# Altium schematic sheet ZHZ_Balance.SchDoc
size A3
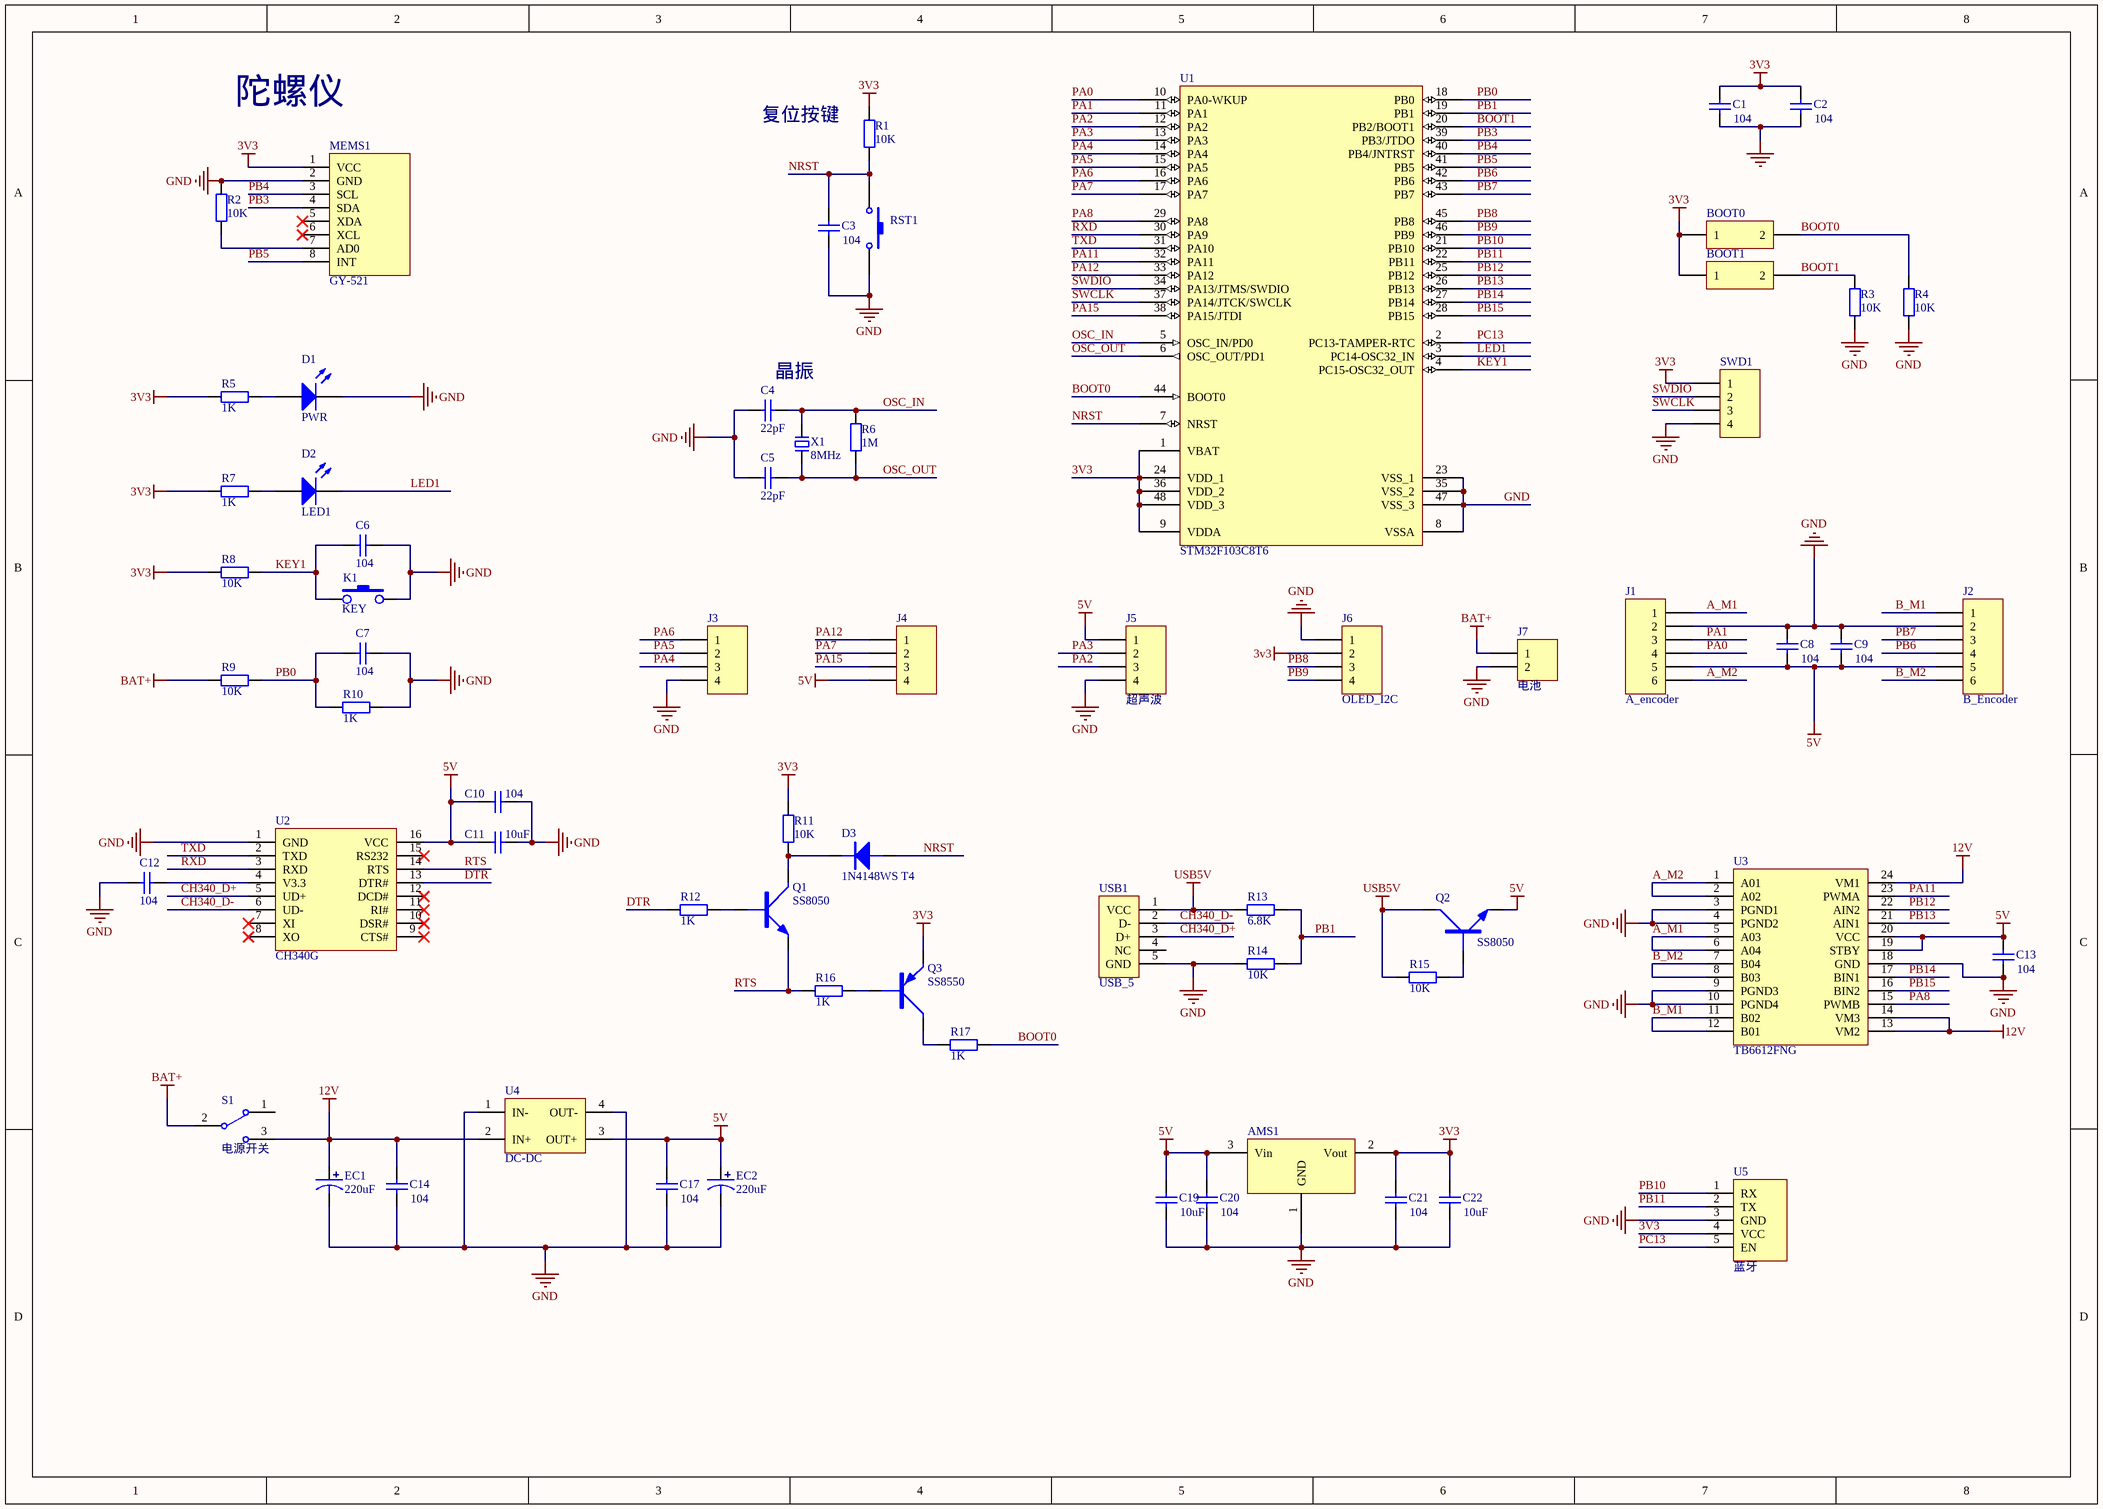
[diagram p0: ZHZ_Balance.SchDoc]

## Parts
AMS1  AMS1117  [SOT223]  (value not drawn)
BOOT0  拨码开关  [二脚排针]  (value not drawn)
BOOT1  拨码开关  [二脚排针]  (value not drawn)
C1  value 104  [0603C]  (hidden comment: Cap)
C2  value 104  [0603C]  (hidden comment: Cap)
C3  value 104  [0805C]  (hidden comment: Cap)
C4  value 22pF  [0805C]  (hidden comment: Cap)
C5  value 22pF  [0805C]  (hidden comment: Cap)
C6  value 104  [0805C]  (hidden comment: Cap)
C7  value 104  [0805C]  (hidden comment: Cap)
C8  value 104  [0805C]  (hidden comment: Cap)
C9  value 104  [0805C]  (hidden comment: Cap)
C10  value 104  [0805C]  (hidden comment: Cap)
C11  value 10uF  [0805C]  (hidden comment: Cap)
C12  value 104  [0805C]  (hidden comment: Cap)
C13  value 104  [0805C]  (hidden comment: Cap)
C14  value 104  [0805C]  (hidden comment: Cap)
C17  value 104  [0805C]  (hidden comment: Cap)
C19  value 10uF  [0805C]  (hidden comment: Cap)
C20  value 104  [0805C]  (hidden comment: Cap)
C21  value 104  [0805C]  (hidden comment: Cap)
C22  value 10uF  [0805C]  (hidden comment: Cap)
D1  PWR  [LED-0805Y]
D2  LED1  [LED-0805Y]
D3  1N4148WS T4  [SOD-123]
EC1  220uF  [SMD-EC8X8X10]
EC2  220uF  [SMD-EC8X8X10]
J1  A_encoder  [XH2.54-WS-6P]
J2  B_Encoder  [XH2.54-WS-6P]
J3  J?  [4脚排针]  (value not drawn)
J4  J?  [4脚排针]  (value not drawn)
J5  超声波  [四脚排母]
J6  OLED_I2C  [四脚排母]
J7  电池  [18650]
K1  KEY  [SMD-3X6X5]
MEMS1  GY-521  [陀螺仪]
Q1  SS8050  [SOT-23]
Q2  SS8050  [SOT-23]
Q3  SS8550  [SOT-23]
R1  value 10K  [0805R]  (hidden comment: Res2)
R2  value 10K  [0805R]  (hidden comment: Res2)
R3  value 10K  [0805R]  (hidden comment: Res2)
R4  value 10K  [0805R]  (hidden comment: Res2)
R5  value 1K  [0805R]  (hidden comment: Res2)
R6  value 1M  [0805R]  (hidden comment: Res2)
R7  value 1K  [0805R]  (hidden comment: Res2)
R8  value 10K  [0805R]  (hidden comment: Res2)
R9  value 10K  [0805R]  (hidden comment: Res2)
R10  value 1K  [0805R]  (hidden comment: Res2)
R11  value 10K  [0805R]  (hidden comment: Res2)
R12  value 1K  [0805R]  (hidden comment: Res2)
R13  value 6.8K  [0805R]  (hidden comment: Res2)
R14  value 10K  [0805R]  (hidden comment: Res2)
R15  value 10K  [0805R]  (hidden comment: Res2)
R16  value 1K  [0805R]  (hidden comment: Res2)
R17  value 1K  [0805R]  (hidden comment: Res2)
RST1  SW-PB  [SMD-3X6X5]  (value not drawn)
S1  电源开关  [SS-12D10]
SWD1  XH-4A  [XH2.54-LI-4P]  (value not drawn)
U1  STM32F103C8T6  [STM32F103C8T6]
U2  CH340G  [SOP16]
U3  TB6612FNG  [SSOP24]
U4  DC-DC  [DC_DC DOWN]
U5  蓝牙  [Fe-HDR1X5/2.54-S]
USB1  USB_5  [USB-MINI-A]
X1  8MHz  [OSC HC-49S]

## Nets
3V3: AMS1.2(Vout) BOOT0.1 BOOT1.1 C1.2 C2.2 C21.2 C22.2 J6.2 MEMS1.1(VCC) Q3.E R1.2 R5.2 R7.2 R8.2 R11.2 SWD1.1 U1.1(VBAT) U1.9(VDDA) U1.24(VDD_1) U1.36(VDD_2) U1.48(VDD_3) U5.4(VCC)
5V: AMS1.3(Vin) C8.1 C9.1 C10.2 C11.2 C13.2 C17.2 C19.2 C20.2 EC2.1 J1.5 J2.5 J4.4 J5.1 Q2.E U2.16(VCC) U3.19(STBY) U3.20(VCC) U4.3(OUT+)
12V: C14.2 EC1.1 S1.3 U3.13(VM2) U3.14(VM3) U3.24(VM1) U4.2(IN+)
BAT+: J7.1 R9.2 S1.2
GND: AMS1.1(GND) C1.1 C2.1 C3.1 C4.2 C5.2 C6.1 C7.1 C8.2 C9.2 C10.1 C11.1 C12.2 C13.1 C14.1 C17.1 C19.1 C20.1 C21.1 C22.1 D1.2(K) EC1.2 EC2.2 J1.2 J2.2 J3.4 J5.4 J6.1 J7.2 K1.2 MEMS1.2(GND) R2.2 R3.1 R4.1 R10.1 R14.2 RST1.2 SWD1.4 U1.8(VSSA) U1.23(VSS_1) U1.35(VSS_2) U1.47(VSS_3) U2.1(GND) U3.3(PGND1) U3.4(PGND2) U3.9(PGND3) U3.10(PGND4) U3.18(GND) U4.1(IN-) U4.4(OUT-) U5.3(GND) USB1.5(GND)
USB5V: Q2.C R13.2 R15.2 USB1.1(VCC)
A_M1: J1.1 U3.5(A03) U3.6(A04)
A_M2: J1.6 U3.1(A01) U3.2(A02)
B_M1: J2.1 U3.11(B02) U3.12(B01)
B_M2: J2.6 U3.7(B04) U3.8(B03)
BOOT0: BOOT0.2 R4.2 R17.1 U1.44(BOOT0)
BOOT1: BOOT1.2 R3.2 U1.20(PB2/BOOT1)
CH340_D+: U2.5(UD+) USB1.3(D+)
CH340_D-: U2.6(UD-) USB1.2(D-)
DTR: R12.2 U2.13(DTR#)
KEY1: C6.2 K1.1 R8.1 U1.4(PC15-OSC32_OUT)
LED1: D2.2(K) U1.3(PC14-OSC32_IN)
NRST: C3.2 D3.A R1.1 RST1.1 U1.7(NRST)
OSC_IN: C4.1 R6.2 U1.5(OSC_IN/PD0) X1.2
OSC_OUT: C5.1 R6.1 U1.6(OSC_OUT/PD1) X1.1
PA0: J1.4 U1.10(PA0-WKUP)
PA1: J1.3 U1.11(PA1)
PA2: J5.3 U1.12(PA2)
PA3: J5.2 U1.13(PA3)
PA4: J3.3 U1.14(PA4)
PA5: J3.2 U1.15(PA5)
PA6: J3.1 U1.16(PA6)
PA7: J4.2 U1.17(PA7)
PA8: U1.29(PA8) U3.15(PWMB)
PA11: U1.32(PA11) U3.23(PWMA)
PA12: J4.1 U1.33(PA12)
PA15: J4.3 U1.38(PA15/JTDI)
PB0: C7.2 R9.1 R10.2 U1.18(PB0)
PB1: R13.1 R14.1 U1.19(PB1)
PB3: MEMS1.4(SDA) U1.39(PB3/JTDO)
PB4: MEMS1.3(SCL) U1.40(PB4/JNTRST)
PB5: MEMS1.8(INT) U1.41(PB5)
PB6: J2.4 U1.42(PB6)
PB7: J2.3 U1.43(PB7)
PB8: J6.3 U1.45(PB8)
PB9: J6.4 U1.46(PB9)
PB10: U1.21(PB10) U5.1(RX)
PB11: U1.22(PB11) U5.2(TX)
PB12: U1.25(PB12) U3.22(AIN2)
PB13: U1.26(PB13) U3.21(AIN1)
PB14: U1.27(PB14) U3.17(BIN1)
PB15: U1.28(PB15) U3.16(BIN2)
PC13: U1.2(PC13-TAMPER-RTC) U5.5(EN)
RTS: Q1.E R16.2 U2.14(RTS)
RXD: U1.30(PA9) U2.3(RXD)
SWCLK: SWD1.3 U1.37(PA14/JTCK/SWCLK)
SWDIO: SWD1.2 U1.34(PA13/JTMS/SWDIO)
TXD: U1.31(PA10) U2.2(TXD)
NetC12_1: C12.1 U2.4(V3.3)
NetD1_1: D1.1(A) R5.1
NetD2_1: D2.1(A) R7.1
NetD3_K: D3.K Q1.C R11.1
NetMEMS1_7: MEMS1.7(AD0) R2.1
NetQ1_B: Q1.B R12.1
NetQ2_B: Q2.B R15.1
NetQ3_B: Q3.B R16.1
NetQ3_C: Q3.C R17.2

Not connected (* = marked no-connect by the designer): MEMS1 5(XDA)* 6(XCL)*; S1 1; U2 7(XI)* 8(XO)* 9(CTS#)* 10(DSR#)* 11(RI#)* 12(DCD#)* 15(RS232)*; USB1 4(NC)

## Notes on the sheet
- 陀螺仪
- 复位按键
- (near C4) 晶振
- Title
- Size:
- Date:
- A3
- Number:
- Time:
- Revision:
- Sheet
- of
- File:

## Library data of the parts
AMS1 = AMS1117: 三端稳压芯片
BOOT0 BOOT1 = BOOT
C1-C14 C17 C19-C22 = Cap: Capacitor; Published: 8-Jun-2000; LatestRevisionDate: 17-Jul-2002; LatestRevisionNote: Re-released for DXP Platform.; PackageReference: RAD-0.3; Publisher: Altium Limited; PackageDescription: Radial Cap, Thru-Hole; 2 Leads; 0.3 in Pin Spacing
D1 D2 = LED0: Typical INFRARED GaAs LED; Published: 8-Jun-2000; LatestRevisionDate: 08-Jul-2005; LatestRevisionNote: Mech Layer 1 removed.; PackageReference: LED-0; Publisher: Altium Limited; PackageDescription: LED; 2 Leads
D3 = DIODE: 普通二极管
EC1 EC2 = SMD_ECAP: 贴片电解电容
J3 J4 = 4xIO
J7 = OLED_I2C_1
MEMS1 = GY-521: MEMS, MPU6050 Compontents; BuildDate-0.1: 2018-4-9; Version: 0.1
Q1 Q2 = NPN: NPN三极管
Q3 = PNP: PNP三极管
R1-R17 = Res2: Resistor; Published: 8-Jun-2000; LatestRevisionDate: 17-Jul-2002; LatestRevisionNote: Re-released for DXP Platform.; PackageReference: AXIAL-0.4; Publisher: Altium Limited; PackageDescription: Axial Device, Thru-Hole; 2 Leads; 0.4 in Pin Spacing
RST1 = SW-PB: Switch; Published: 24-Mar-1999; LatestRevisionDate: 17-Jul-2002; LatestRevisionNote: Re-released for DXP Platform.; PackageReference: SPST-2; Publisher: Altium Limited; PackageDescription: Switch; 2 Leads
S1 = SS-12F23
SWD1 = Header 4: Header, 4-Pin; LatestRevisionDate: 17-Jul-2002; LatestRevisionNote: Re-released for DXP Platform.; Publisher: Altium Limited
U2 = CH340
U4 = DC-DC: Power Module; BuildDate-0.1: 2018-3-16; Version: 0.1
X1 = XTAL-2P: 2脚无源脚晶振